# EasyEDA schematic SCH_PCB-device_2024-08-05.json
TITLE: Sheet_1; REV: 1.0; Date: 2024-08-05; Sheet: 1/1; Drawn By: hackerboi; Company: Your Company
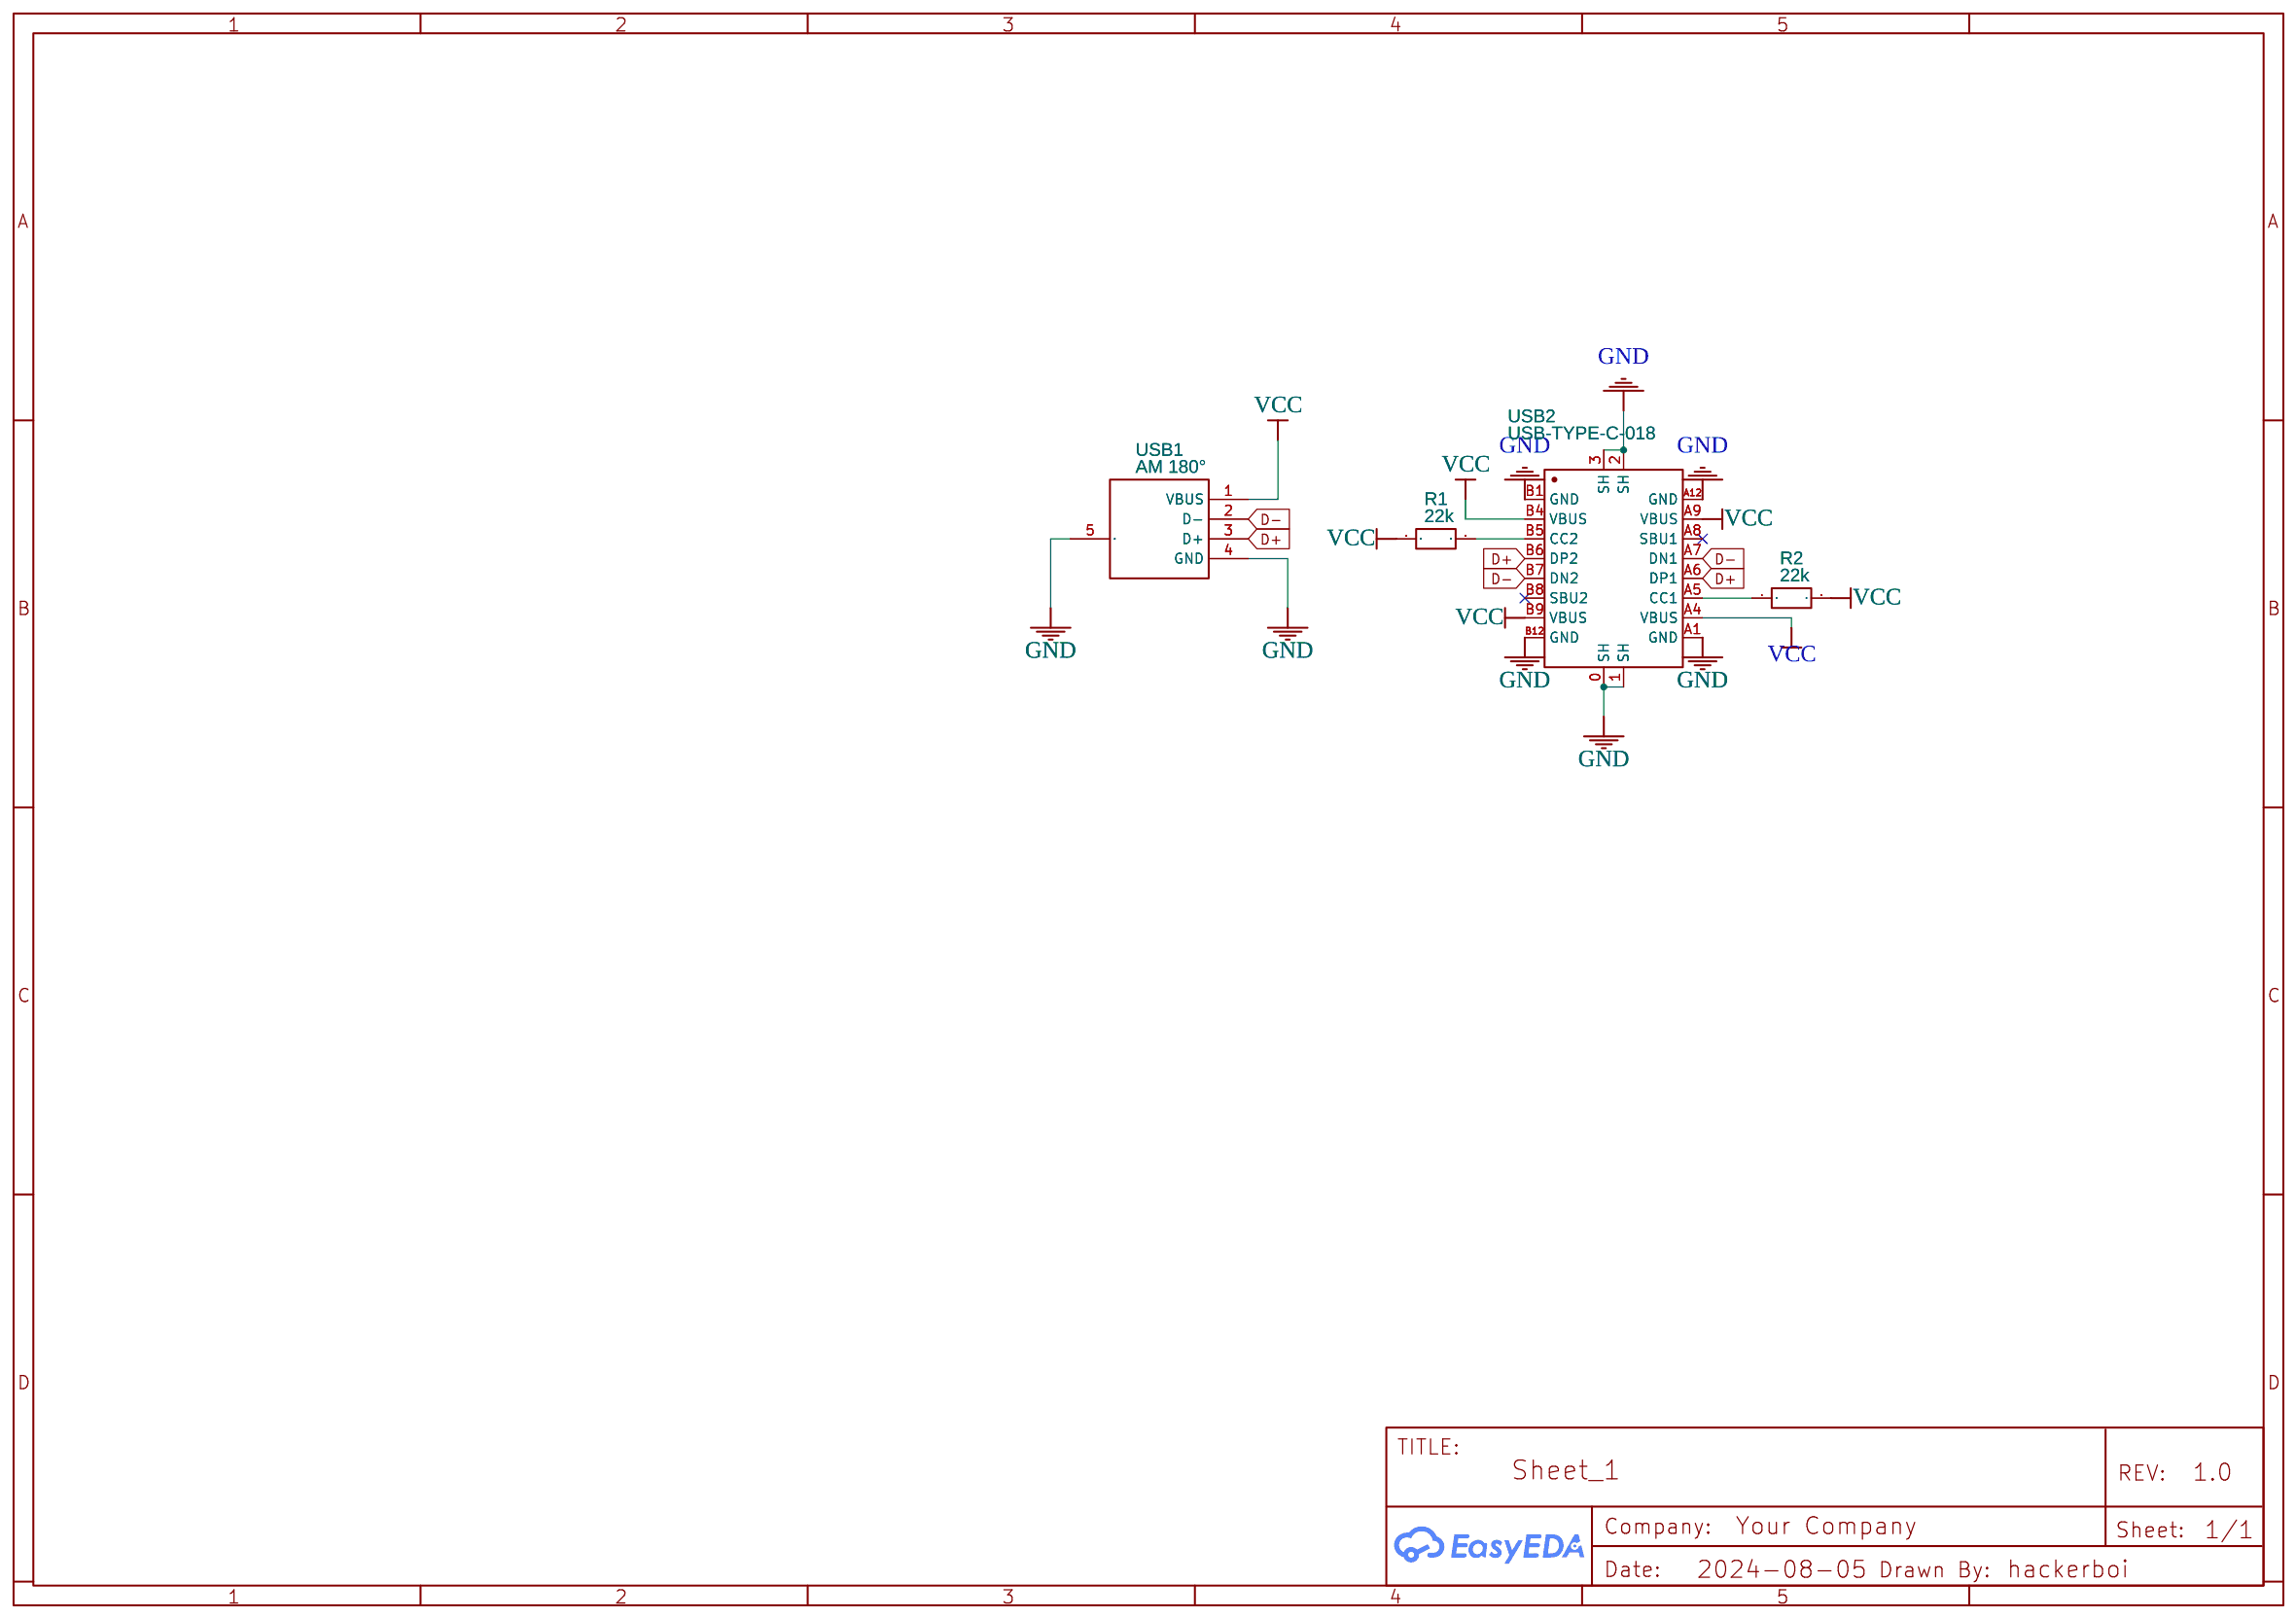
[diagram p0: schematic sheet]

## Parts
R1  22k  [R0603]
R2  22k  [R0603]
USB1  AM 180°  [USB-SMD_AM180]
USB2  USB-TYPE-C-018  [USB-C_SMD-TYPE-C-31-M-12]

## Library data of the parts
R1 R2 = R_0603_EU: Contributor: LCEDA_Lib
USB1 = AM 180°: Contributor: LCSC; Supplier: LCSC; Supplier Part: C2681564; Manufacturer: SHOU HAN(首韩); JLCPCB Part Class: Extended Part
USB2 = USB-TYPE-C-018: Contributor: LCSC; Supplier: LCSC; Supplier Part: C2927038; Manufacturer: DEALON(德艺隆); JLCPCB Part Class: Extended Part

## Nets
GND: USB1.4(GND) USB1.5(EH) USB2.0(SH) USB2.1(SH) USB2.2(SH) USB2.3(SH) USB2.A1(GND) USB2.A12(GND) USB2.B1(GND) USB2.B12(GND)
VCC: R1.1 R2.2 USB1.1(VBUS) USB2.A4(VBUS) USB2.A9(VBUS) USB2.B4(VBUS) USB2.B9(VBUS)
D+: USB1.3(D+) USB2.A6(DP1) USB2.B6(DP2)
D-: USB1.2(D-) USB2.A7(DN1) USB2.B7(DN2)
Net-(R1-2): R1.2 USB2.B5(CC2)
Net-(R2-1): R2.1 USB2.A5(CC1)

Not connected (* = marked no-connect by the designer): USB2 A8(SBU1)* B8(SBU2)*
